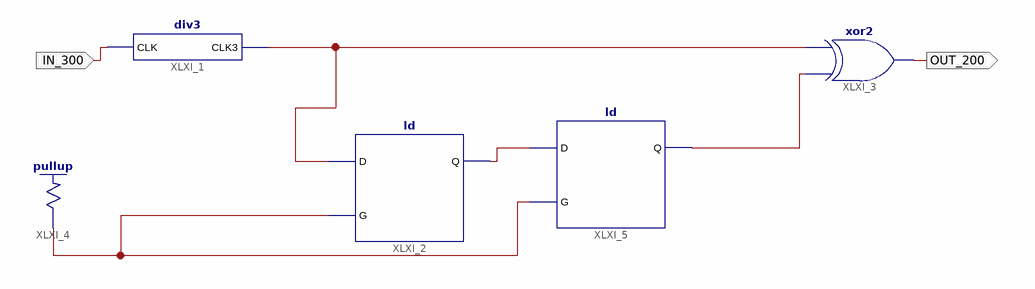
[diagram p0: schematic sheet 1]
// Xilinx ISE schematic clk_300_to_200.sch (xbr) as structural Verilog: 5 symbols, 2 ports
module clk_300_to_200 (
  input  IN_300,
  output OUT_200
);

  wire XLXN_1, XLXN_2, XLXN_4, XLXN_6;

  div3 XLXI_1 (.CLK(IN_300), .CLK3(XLXN_2));
  ld XLXI_2 (.D(XLXN_2), .G(XLXN_4), .Q(XLXN_1));
  xor XLXI_3 (OUT_200, XLXN_6, XLXN_2);
  \pullup  XLXI_4 (.O(XLXN_4));
  ld XLXI_5 (.D(XLXN_1), .G(XLXN_4), .Q(XLXN_6));
endmodule
